# EAGLE design ThermoTop_C (EAGLE 6.5.0)
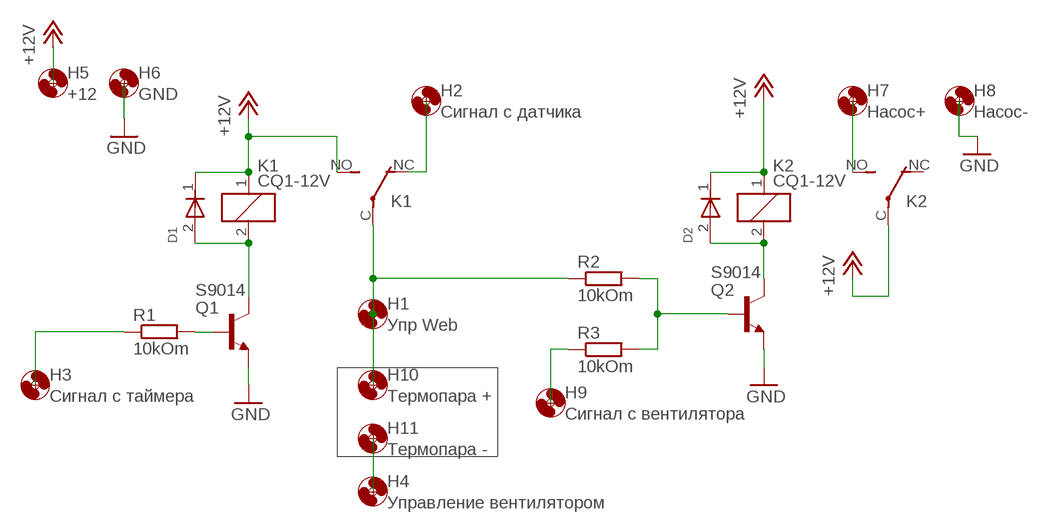
[diagram p0: schematic, sheet 1]

## Parts
D1  DIODE  [SOD80]
D2  DIODE  [SOD80]
H1  Упр Web  MOUNT-HOLE2.8  [2,8]
H2  Сигнал с датчика  MOUNT-HOLE2.8  [2,8]
H3  Сигнал с таймера  MOUNT-HOLE2.8  [2,8]
H4  Управление вентилятором  MOUNT-HOLE2.8  [2,8]
H5  +12  MOUNT-HOLE3.0  [3,0]
H6  GND  MOUNT-HOLE3.0  [3,0]
H7  Насос+  MOUNT-HOLE3.0  [3,0]
H8  Насос-  MOUNT-HOLE3.0  [3,0]
H9  Сигнал с вентилятора  MOUNT-HOLE2.8  [2,8]
H10  Термопара +  MOUNT-HOLE2.8  [2,8]
H11  Термопара -  MOUNT-HOLE2.8  [2,8]
K1  CQ1-12V  [CQ1]
K2  CQ1-12V  [CQ1]
Q1  S9014  2N3904  [TO92]
Q2  S9014  2N3904  [TO92]
R1  10kOm  R-EU_R0603  [R0603]
R2  10kOm  R-EU_R0603  [R0603]
R3  10kOm  R-EU_R0603  [R0603]

## Nets
+12V: D1.1(KATOD) D2.1(KATOD) H5.P$1 K1.1 K1.NO(2:S) K2.1 K2.C(2:P)
GND: H6.P$1 H8.P$1 Q1.3(E) Q2.3(E)
N$1: D1.2(ANOD) K1.2 Q1.1(C)
N$2: Q1.2(B) R1.2
N$3: H3.P$1 R1.1
N$4: H1.P$1 H10.P$1 K1.C(2:P) R2.1
N$5: H4.P$1 H11.P$1
N$6: H2.P$1 K1.NC(2:O)
N$7: H7.P$1 K2.NO(2:S)
N$8: Q2.2(B) R2.2 R3.2
N$9: D2.2(ANOD) K2.2 Q2.1(C)
N$11: H9.P$1 R3.1
Unconnected: K2.NC(2:O)

## Library data of the parts
D1 D2 = usb:DIODE: DIODE
H1-H11 = holes:MOUNT-HOLE: MOUNTING HOLE with drill center marker
K1 K2 = relay:CQ1-12V: AUTOMOTIVE QUIET RELAY NAiS Source: http://www.mew-europe.com/.. en_ds_61208_0000.pdf; OC_FARNELL: unknown; OC_NEWARK: unknown
Q1 Q2 = transistor-npn:2N3904: NPN Transistor
R1-R3 = rcl:R-EU_: RESISTOR, European symbol

## Board
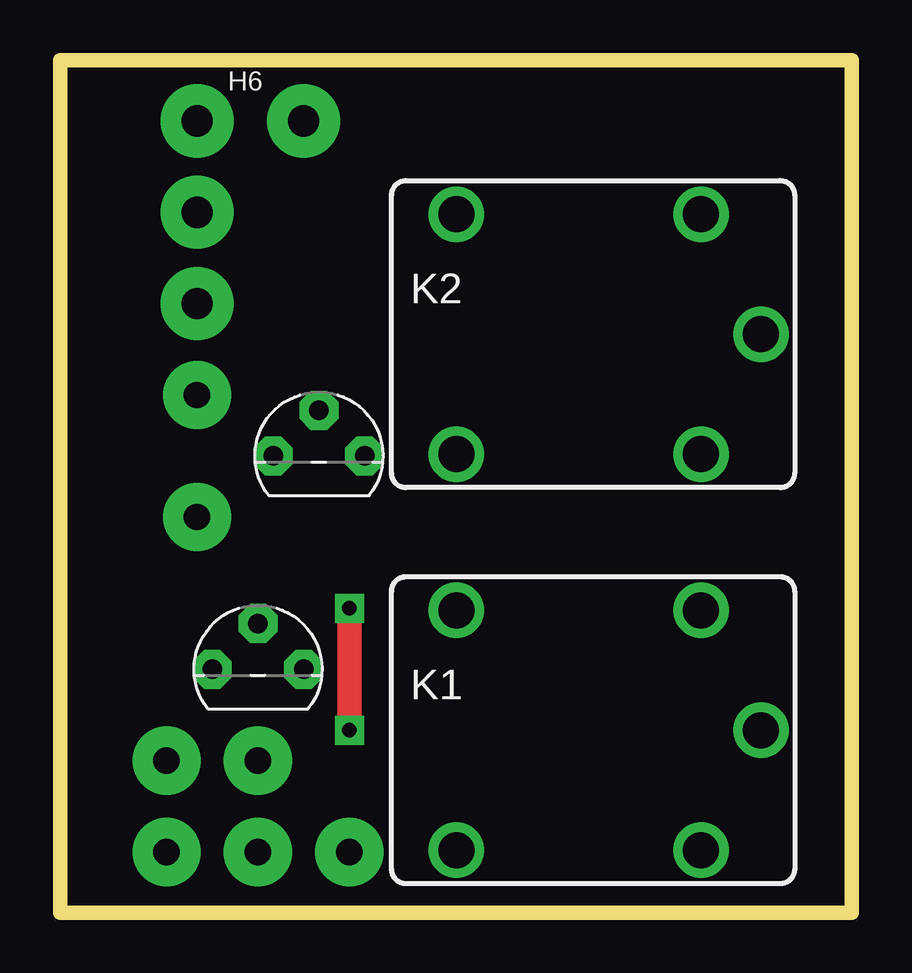
[diagram p1: board, top side]
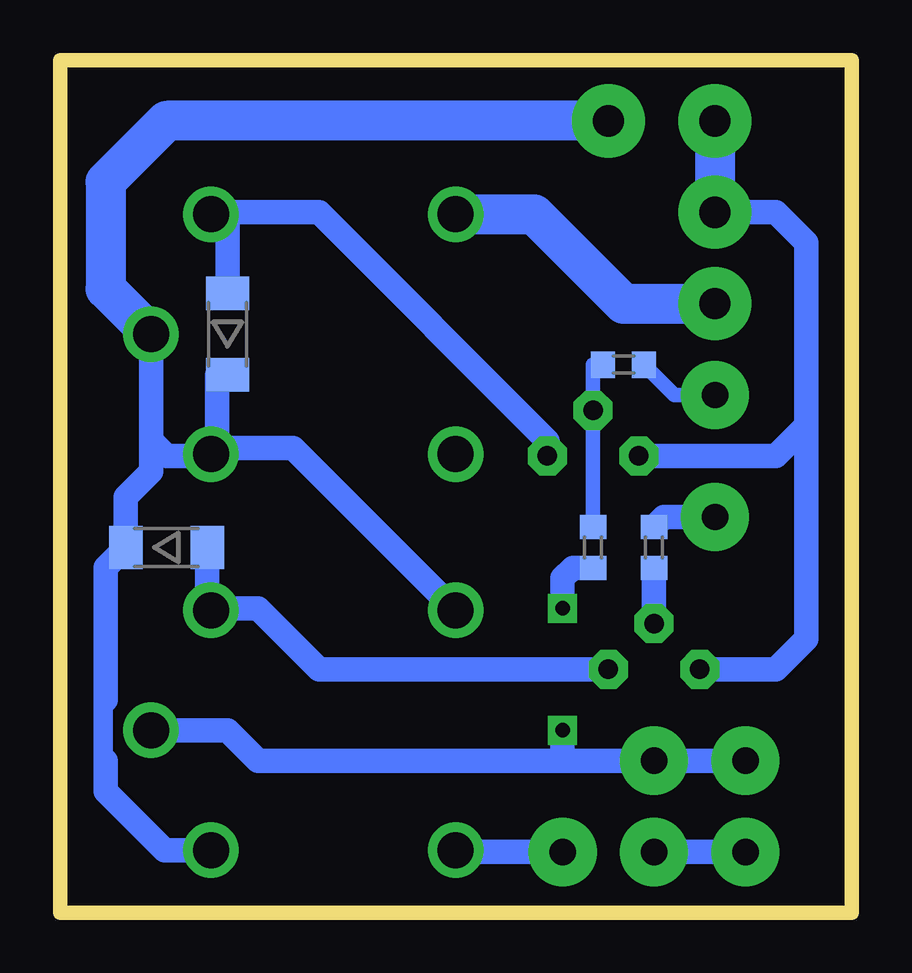
[diagram p2: board, bottom side, seen from below]

Size 33.02 x 35.56 mm. Coordinates in mm from the lower left corner, seen from the top.
Outline: 0,35.56 33.02,35.56 33.02,0 0,0 0,35.56
Copper layers (1*16): Top 0.035mm / dielectric 1.5mm / Bottom 0.035mm
Design rules "default": minimum track width 12mil, minimum drill 32mil, track to track 12mil, track to pad 12mil, pad to pad 12mil, via to via 12mil, smd to smd 8mil, copper to edge 40mil, drill to drill 8mil, minimum pad ring 16mil, minimum via ring 12mil, stop-mask expansion 4mil, vias tented up to drill 0mil, thermal gap 20mil

### Footprints (pad centres in the part's own frame; a part is rotated, then mirrored left to right if it is on the bottom)
SOD80 = smd 1.4 x 1.8: 1 -1.7,0; 2 1.7,0
2,8 = drill 1.1 pad 2.845: P$1 0,0
3,0 = drill 1.3 pad 3.048: P$1 0,0
CQ1 = drill 1.5: 1 4.5,-5; 2 4.5,5; C 7,0; NC -5.7,-5; NO -5.7,5
TO92 = drill 0.813 octagon: 1 1.905,0; 2 0,1.905; 3 -1.905,0
R0603 = smd 1 x 1.1: 1 -0.85,0; 2 0.85,0

### Placement (x,y rotation side)
D1  28.57,15.24 0 bottom
D2  26.04,24.13 90 bottom
H1  4.45,6.35 0 top
H2  12.06,2.54 0 top
H3  5.71,16.51 0 top
H4  4.45,2.54 0 top
H5  10.16,33.02 0 top
H6  5.71,33.02 0 top
H7  5.71,25.4 0 top
H8  5.71,29.21 0 top
H9  5.71,21.59 0 top
H10  8.26,6.35 0 top
H11  8.26,2.54 0 top
K1  22.23,7.62 0 top
K2  22.23,24.13 0 top
Q1  8.26,10.16 0 top
Q2  10.79,19.05 0 top
R1  8.26,15.24 270 bottom
R2  10.79,15.24 90 bottom
R3  9.53,22.86 180 bottom

### Tracks (layer width: path | path; a pad name or v marks a point on that pad's centre or on a via)
+12V
  Bottom 0.406: D2.1 26.46,22.43
  Bottom 0.61: 31.11,8.89 31.11,6.35
  Bottom 1.016: K2.C 29.23,20.32 29.23,19.7 | 29.23,19.7 28.57,19.05 26.8,19.05 K2.1 26.46,19.39 | 26.46,22.43 26.46,19.39 | 26.46,19.39 23.3,19.39 K1.NO | K1.1 28.66,2.62 31.11,5.08 31.11,6.35 | 31.11,8.89 31.11,14.4 D1.1 30.27,17.35 29.23,18.4 29.23,19.7
  Bottom 1.676: H5.P$1 28.57,33.02 31.11,30.48 31.11,26.02 K2.C
GND
  Bottom 1.016: H8.P$1 3.17,29.21 1.91,27.94 1.91,20.32 | 1.91,20.32 1.91,11.43 3.17,10.16 Q1.3 | Q2.3 3.17,19.05 1.91,20.32
  Bottom 1.676: H6.P$1 H8.P$1
N$1
  Bottom 1.016: Q1.1 22.23,10.16 24.77,12.7 26.64,12.7 K1.2 26.88,12.77 D1.2
N$2
  Bottom 0.406: R1.2 8.26,14.61
  Bottom 1.016: R1.2 Q1.2
N$3
  Bottom 1.016: H3.P$1 7.83,16.51 R1.1
N$4  (via drill 0.6)
  Top 1.016: v12.06,12.7 v12.06,7.62
  Bottom 1.016: H1.P$1 H10.P$1 12.06,6.35 | 12.06,6.35 24.77,6.35 26.04,7.62 K1.C | v12.06,12.7 12.06,13.97 11.64,14.39 R2.1 | v12.06,7.62 12.06,6.35
N$5
  Bottom 1.016: H4.P$1 H11.P$1
N$6
  Bottom 1.016: H2.P$1 16.45,2.54 K1.NC
N$7
  Bottom 1.676: K2.NO 13.26,29.13 9.53,25.4 H7.P$1
N$8
  Bottom 0.61: R3.2 10.79,22.86 Q2.2 R2.2
N$9
  Bottom 1.016: Q2.1 12.7,19.68 22.23,29.21 26.04,29.21 | 26.04,29.21 26.64,29.21 K2.2 26.11,29.13 26.04,29.21 | 26.04,29.21 D2.2
N$10
  Bottom 0.61: 31.32,8.89 31.32,6.35
N$11
  Bottom 0.61: H9.P$1 7.41,21.59 R3.1